# EAGLE design sfg_clone (EAGLE 7.5.0)
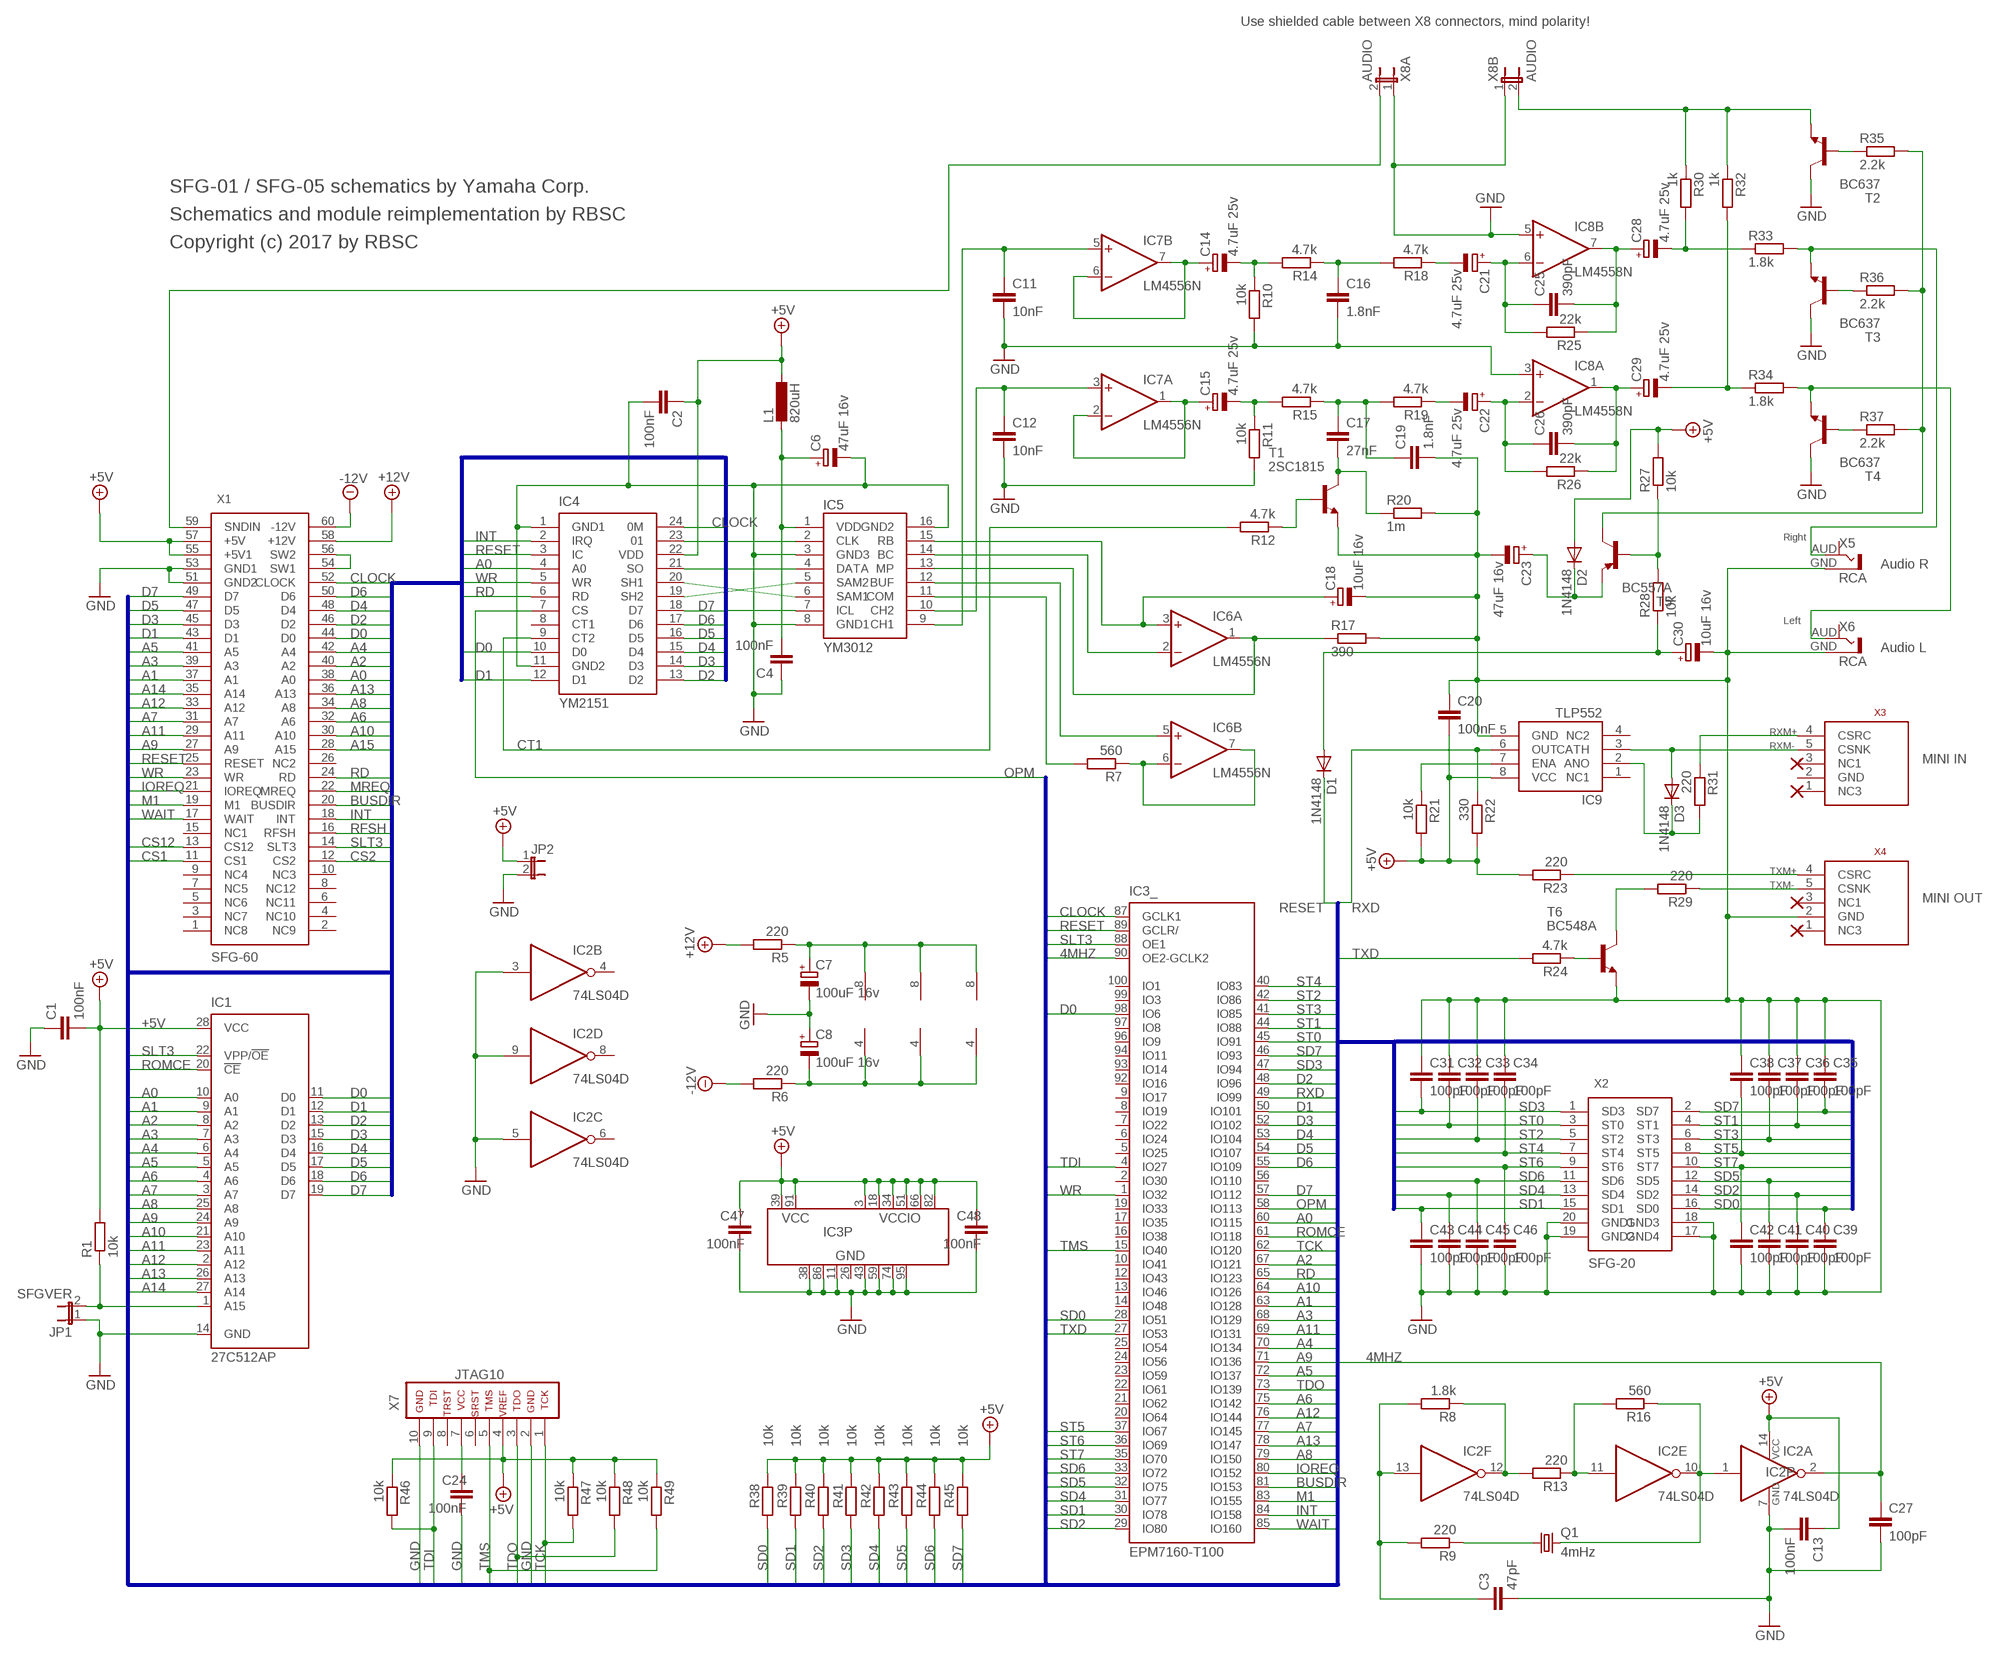
[diagram p0: schematic, sheet 1]

## Parts
C1  100nF  C-EUC0805  [C0805]
C2  100nF  C-EUC0805  [C0805]
C3  47pF  C-EUC0805  [C0805]
C4  100nF  C-EUC0805  [C0805]
C6  47uF 16v  CPOL-EUSMCC  [SMC_C]
C7  100uF 16v  CPOL-EUSMCD  [SMC_D]
C8  100uF 16v  CPOL-EUSMCD  [SMC_D]
C11  10nF  C-EUC0805  [C0805]
C12  10nF  C-EUC0805  [C0805]
C13  100nF  C-EUC0805  [C0805]
C14  4.7uF 25v  CPOL-EUSMCB  [SMC_B]
C15  4.7uF 25v  CPOL-EUSMCB  [SMC_B]
C16  1.8nF  C-EUC0805  [C0805]
C17  27nF  C-EUC0805  [C0805]
C18  10uF 16v  CPOL-EUSMCB  [SMC_B]
C19  1.8nF  C-EUC0805  [C0805]
C20  100nF  C-EUC0805  [C0805]
C21  4.7uF 25v  CPOL-EUSMCB  [SMC_B]
C22  4.7uF 25v  CPOL-EUSMCB  [SMC_B]
C23  47uF 16v  CPOL-EUSMCC  [SMC_C]
C24  100nF  C-EUC0805  [C0805]
C25  390pF  C-EUC0805  [C0805]
C26  390pF  C-EUC0805  [C0805]
C27  100pF  C-EUC0805  [C0805]
C28  4.7uF 25v  CPOL-EUSMCB  [SMC_B]
C29  4.7uF 25v  CPOL-EUSMCB  [SMC_B]
C30  10uF 16v  CPOL-EUSMCB  [SMC_B]
C31  100pF  C-EUC0805  [C0805]
C32  100pF  C-EUC0805  [C0805]
C33  100pF  C-EUC0805  [C0805]
C34  100pF  C-EUC0805  [C0805]
C35  100pF  C-EUC0805  [C0805]
C36  100pF  C-EUC0805  [C0805]
C37  100pF  C-EUC0805  [C0805]
C38  100pF  C-EUC0805  [C0805]
C39  100pF  C-EUC0805  [C0805]
C40  100pF  C-EUC0805  [C0805]
C41  100pF  C-EUC0805  [C0805]
C42  100pF  C-EUC0805  [C0805]
C43  100pF  C-EUC0805  [C0805]
C44  100pF  C-EUC0805  [C0805]
C45  100pF  C-EUC0805  [C0805]
C46  100pF  C-EUC0805  [C0805]
C47  100nF  C-EUC0805  [C0805]
C48  100nF  C-EUC0805  [C0805]
D1  1N4148  DIODE-MINIMELF  [MINIMELF]
D2  1N4148  DIODE-MINIMELF  [MINIMELF]
D3  1N4148  DIODE-MINIMELF  [MINIMELF]
IC1  27C512AP  [DIL28-6]
IC2  74LS04D  [SO14]
IC3  EPM7160-T100  [TQFP100]
IC4  YM2151  [DIL24]
IC5  YM3012  [DIL16]
IC6  LM4556N  [DIL08]
IC7  LM4556N  [DIL08]
IC8  LM4558N  [DIL08]
IC9  TLP552  [DIL08]
JP1  SFGVER  JP1E  [JP1]
JP2  JP1E  [JP1]
L1  820uH  L-EU6000-XXX-RC  [6000-XXXX-RC]
Q1  4mHz  CRYSTALHC49S  [HC49/S]
R1  10k  R-EU_R0805  [R0805]
R5  220  R-EU_R0805  [R0805]
R6  220  R-EU_R0805  [R0805]
R7  560  R-EU_R0805  [R0805]
R8  1.8k  R-EU_R0805  [R0805]
R9  220  R-EU_R0805  [R0805]
R10  10k  R-EU_R0805  [R0805]
R11  10k  R-EU_R0805  [R0805]
R12  4.7k  R-EU_R0805  [R0805]
R13  220  R-EU_R0805  [R0805]
R14  4.7k  R-EU_R0805  [R0805]
R15  4.7k  R-EU_R0805  [R0805]
R16  560  R-EU_R0805  [R0805]
R17  390  R-EU_R0805  [R0805]
R18  4.7k  R-EU_R0805  [R0805]
R19  4.7k  R-EU_R0805  [R0805]
R20  1m  R-EU_R0805  [R0805]
R21  10k  R-EU_R0805  [R0805]
R22  330  R-EU_R0805  [R0805]
R23  220  R-EU_R0805  [R0805]
R24  4.7k  R-EU_R0805  [R0805]
R25  22k  R-EU_R0805  [R0805]
R26  22k  R-EU_R0805  [R0805]
R27  10k  R-EU_R0805  [R0805]
R28  10k  R-EU_R0805  [R0805]
R29  220  R-EU_R0805  [R0805]
R30  1k  R-EU_R0805  [R0805]
R31  220  R-EU_R0805  [R0805]
R32  1k  R-EU_R0805  [R0805]
R33  1.8k  R-EU_R0805  [R0805]
R34  1.8k  R-EU_R0805  [R0805]
R35  2.2k  R-EU_R0805  [R0805]
R36  2.2k  R-EU_R0805  [R0805]
R37  2.2k  R-EU_R0805  [R0805]
R38  10k  R-EU_R0805  [R0805]
R39  10k  R-EU_R0805  [R0805]
R40  10k  R-EU_R0805  [R0805]
R41  10k  R-EU_R0805  [R0805]
R42  10k  R-EU_R0805  [R0805]
R43  10k  R-EU_R0805  [R0805]
R44  10k  R-EU_R0805  [R0805]
R45  10k  R-EU_R0805  [R0805]
R46  10k  R-EU_R0805  [R0805]
R47  10k  R-EU_R0805  [R0805]
R48  10k  R-EU_R0805  [R0805]
R49  10k  R-EU_R0805  [R0805]
T1  2SC1815  [TO92-ECB]
T2  BC637  BC637-NPN-TO92-ECB  [TO92-ECB]
T3  BC637  BC637-NPN-TO92-ECB  [TO92-ECB]
T4  BC637  BC637-NPN-TO92-ECB  [TO92-ECB]
T5  BC557A  [TO92-EBC]
T6  BC548A  [TO92-EBC]
X1  SFG-60  [SFG-60]
X2  SFG-20  [SFG-20]
X3  MIDI_CONN_FEMALE_SUPPORT  [DIN_5_FEMALE_SUPPORT]
X4  MIDI_CONN_FEMALE_SUPPORT  [DIN_5_FEMALE_SUPPORT]
X5  RCA  [RCA]
X6  RCA  [RCA]
X7  JTAG10  [JTAG10]
X8A  AUDIO  JP1E  [JP1]
X8B  AUDIO  JP1E  [JP1]

## Nets
4MHZ: C27.1 IC2.2(A:O) IC3.90(_:OE2-GCLK2)
+5V: C1.2 C2.1 C13.1 C20.2 C47.1 C48.1 D2.A IC1.28(VCC) IC2.14(P:VCC) IC3.3(P:VCCIO) IC3.18(P:VCCIO) IC3.34(P:VCCIO) IC3.39(P:VCC) IC3.51(P:VCCIO) IC3.66(P:VCCIO) IC3.82(P:VCCIO) IC3.91(P:VCC) IC4.22(VDD) IC9.8(VCC) JP2.1 L1.1 R1.2 R21.2 R22.2 R23.2 R27.2 R38.1 R39.1 R40.1 R41.1 R42.1 R43.1 R44.1 R45.1 R46.1 R47.1 R48.1 R49.1 X1.55(+5V1) X1.57(+5V) X7.4
+12V: R5.2 X1.58(+12V)
+12V1: C7.+ IC6.8(P:V+) IC7.8(P:V+) IC8.8(P:V+) R5.1
-12V: R6.2 X1.60(-12V)
-12V1: C8.- IC6.4(P:V-) IC7.4(P:V-) IC8.4(P:V-) R6.1
A0: IC1.10(A0) IC3.60(_:IO115) IC4.4(A0) X1.38(A0)
A1: IC1.9(A1) IC3.63(_:IO128) X1.37(A1)
A2: IC1.8(A2) IC3.67(_:IO121) X1.40(A2)
A3: IC1.7(A3) IC3.68(_:IO129) X1.39(A3)
A4: IC1.6(A4) IC3.70(_:IO134) X1.42(A4)
A5: IC1.5(A5) IC3.72(_:IO137) X1.41(A5)
A6: IC1.4(A6) IC3.75(_:IO142) X1.32(A6)
A7: IC1.3(A7) IC3.77(_:IO145) X1.31(A7)
A8: IC1.25(A8) IC3.79(_:IO150) X1.34(A8)
A9: IC1.24(A9) IC3.71(_:IO136) X1.27(A9)
A10: IC1.21(A10) IC3.64(_:IO126) X1.30(A10)
A11: IC1.23(A11) IC3.69(_:IO131) X1.29(A11)
A12: IC1.2(A12) IC3.76(_:IO144) X1.33(A12)
A13: IC1.26(A13) IC3.78(_:IO147) X1.36(A13)
A14: IC1.27(A14) X1.35(A14)
A15: X1.28(A15)
BUSDIR: IC3.81(_:IO153) X1.20(BUSDIR)
CLOCK: IC3.87(_:GCLK1) IC4.24(0M) X1.52(CLOCK)
CS1: X1.11(CS1)
CS2: X1.12(CS2)
CS12: X1.13(CS12)
CT1: IC4.9(CT2) R12.2
D0: IC1.11(D0) IC3.98(_:IO6) IC4.10(D0) X1.44(D0)
D1: IC1.12(D1) IC3.50(_:IO101) IC4.12(D1) X1.43(D1)
D2: IC1.13(D2) IC3.48(_:IO96) IC4.13(D2) X1.46(D2)
D3: IC1.15(D3) IC3.52(_:IO102) IC4.14(D3) X1.45(D3)
D4: IC1.16(D4) IC3.53(_:IO104) IC4.15(D4) X1.48(D4)
D5: IC1.17(D5) IC3.54(_:IO107) IC4.16(D5) X1.47(D5)
D6: IC1.18(D6) IC3.55(_:IO109) IC4.17(D6) X1.50(D6)
D7: IC1.19(D7) IC3.57(_:IO112) IC4.18(D7) X1.49(D7)
GND: C1.1 C2.2 C3.2 C4.1 C6.- C7.- C8.+ C11.2 C12.2 C13.2 C16.2 C18.- C19.2 C20.1 C23.- C24.2 C27.2 C30.- C31.1 C32.1 C33.1 C34.1 C35.1 C36.1 C37.1 C38.1 C39.2 C40.2 C41.2 C42.2 C43.2 C44.2 C45.2 C46.2 C47.2 C48.2 IC1.14(GND) IC2.3(B:I) IC2.5(C:I) IC2.7(P:GND) IC2.9(D:I) IC3.11(P:GND) IC3.38(P:GND) IC3.43(P:GND) IC3.59(P:GND) IC3.74(P:GND) IC3.86(P:GND) IC3.95(P:GND) IC4.1(GND1) IC4.11(GND2) IC5.3(GND3) IC5.8(GND1) IC5.16(GND2) IC8.3(A:+IN) IC8.5(B:+IN) IC9.5(GND) JP1.1 JP2.2 R10.2 R11.2 R17.2 R20.2 T1.E T2.C T3.C T4.C T6.E X1.51(GND2) X1.53(GND1) X2.17(GND4) X2.18(GND3) X2.19(GND2) X2.20(GND1) X4.2(GND) X5.GND(GND1) X6.GND(GND1) X7.2 X7.10 X8A.1 X8B.1
INT: IC3.84(_:IO158) IC4.2(IRQ) X1.18(INT)
IOREQ: IC3.80(_:IO152) X1.21(IOREQ)
M1: IC3.83(_:IO155) X1.19(M1)
MREQ: X1.22(MREQ)
N$1: IC1.1(A15) JP1.2 R1.1
N$2: C24.1 X7.7
N$3: X1.54(SW1) X1.56(SW2)
N$4: R30.1 R32.1 T2.E X8B.2
N$5: X1.59(SNDIN) X8A.2
N$8: C3.1 IC2.13(F:I) R8.2 R9.2
N$13: IC2.12(F:O) R8.1 R13.2
N$15: IC2.1(A:I) IC2.10(E:O) Q1.2 R16.1
N$16: Q1.1 R9.1
N$17: IC2.11(E:I) R13.1 R16.2
N$21: R24.1 T6.B
N$22: R29.2 T6.C
N$23: R29.1 X4.5(CSNK)
N$24: R23.1 X4.4(CSRC)
N$26: D3.A IC9.3(CATH) X3.5(CSNK)
N$27: R31.1 X3.4(CSRC)
N$28: IC9.7(ENA) R21.1
N$29: D3.C IC9.2(ANO) R31.2
N$30: IC4.23 IC5.2(CLK)
N$31: IC4.21(SO) IC5.4(DATA)
N$32: C28.- R30.2 R33.1
N$33: IC4.20(SH1) IC5.6(SAM1)
N$34: C4.2 C6.+ IC5.1(VDD) L1.2
N$35: IC4.19(SH2) IC5.5(SAM2)
N$37: IC6.6(B:-IN) IC6.7(B:OUT) R7.1
N$38: IC5.11(COM) R7.2
N$39: C12.1 IC5.10(CH2) IC7.3(A:+IN)
N$40: IC5.12(BUF) IC6.5(B:+IN)
N$41: IC5.13(MP) IC6.1(A:OUT) R17.1
N$42: C18.+ IC5.15(RB) IC6.3(A:+IN)
N$43: C21.+ C25.1 IC8.6(B:-IN) R25.2
N$44: C14.+ IC7.6(B:-IN) IC7.7(B:OUT)
N$45: C15.+ IC7.1(A:OUT) IC7.2(A:-IN)
N$46: C11.1 IC5.9(CH1) IC7.5(B:+IN)
N$47: C14.- R10.1 R14.2
N$48: C15.- R11.1 R15.2
N$49: IC5.14(BC) IC6.2(A:-IN)
N$50: C17.2 R20.1 T1.C
N$51: C16.1 R14.1 R18.2
N$52: C17.1 C19.1 R15.1 R19.2
N$53: C22.+ C26.1 IC8.2(A:-IN) R26.2
N$54: C22.- R19.1
N$55: C21.- R18.1
N$56: R12.1 T1.B
N$57: C26.2 C29.+ IC8.1(A:OUT) R26.1
N$58: C25.2 C28.+ IC8.7(B:OUT) R25.1
N$60: C29.- R32.2 R34.1
N$61: R33.2 T3.E X5.AUD
N$62: R34.2 T4.E X6.AUD
N$63: R35.1 T2.B
N$64: R35.2 R36.2 R37.2 T5.C
N$65: R36.1 T3.B
N$66: R37.1 T4.B
N$67: C30.+ D1.A R28.1
N$68: C23.+ D2.C T5.E
N$69: R27.1 R28.2 T5.B
OPM: IC3.58(_:IO113) IC4.7(CS)
RD: IC3.65(_:IO123) IC4.6(RD) X1.24(RD)
RESET: D1.C IC3.89(_:GCLR/) IC4.3(IC) IC5.7(ICL) X1.25(RESET)
RFSH: X1.16(RFSH)
ROMCE: IC1.20(!CE) IC3.61(_:IO118)
RXD: IC3.49(_:IO99) IC9.6(OUT) R22.1
SD0: C39.1 IC3.28(_:IO51) R38.2 X2.16(SD0)
SD1: C43.1 IC3.30(_:IO78) R39.2 X2.15(SD1)
SD2: C40.1 IC3.29(_:IO80) R40.2 X2.14(SD2)
SD3: C31.2 IC3.47(_:IO94) R41.2 X2.1(SD3)
SD4: C44.1 IC3.31(_:IO77) R42.2 X2.13(SD4)
SD5: C41.1 IC3.32(_:IO75) R43.2 X2.12(SD5)
SD6: C45.1 IC3.33(_:IO72) R44.2 X2.11(SD6)
SD7: C35.2 IC3.46(_:IO93) R45.2 X2.2(SD7)
SLT3: IC1.22(VPP/!OE) IC3.88(_:OE1) X1.14(SLT3)
ST0: C32.2 IC3.45(_:IO91) X2.3(ST0)
ST1: C36.2 IC3.44(_:IO88) X2.4(ST1)
ST2: C33.2 IC3.42(_:IO86) X2.5(ST2)
ST3: C37.2 IC3.41(_:IO85) X2.6(ST3)
ST4: C34.2 IC3.40(_:IO83) X2.7(ST4)
ST5: C38.2 IC3.37(_:IO67) X2.8(ST5)
ST6: C46.1 IC3.36(_:IO69) X2.9(ST6)
ST7: C42.1 IC3.35(_:IO70) X2.10(ST7)
TCK: IC3.62(_:IO120) R47.2 X7.1
TDI: IC3.4(_:IO27) R46.2 X7.9
TDO: IC3.73(_:IO139) R48.2 X7.3
TMS: IC3.15(_:IO40) R49.2 X7.5
TXD: IC3.27(_:IO53) R24.2
WAIT: IC3.85(_:IO160) X1.17(WAIT)
WR: IC3.1(_:IO32) IC4.5(WR) X1.23(WR)
Unconnected: IC2.4(B:O) IC2.6(C:O) IC2.8(D:O) IC3.2(_:IO30) IC3.5(_:IO25) IC3.6(_:IO24) IC3.7(_:IO22) IC3.8(_:IO19) IC3.9(_:IO17) IC3.10(_:IO41) IC3.12(_:IO43) IC3.13(_:IO46) IC3.14(_:IO48) IC3.16(_:IO38) IC3.17(_:IO35) IC3.19(_:IO33) IC3.20(_:IO64) IC3.21(_:IO62) IC3.22(_:IO61) IC3.23(_:IO59) IC3.24(_:IO56) IC3.25(_:IO54) IC3.56(_:IO110) IC3.92(_:IO16) IC3.93(_:IO14) IC3.94(_:IO11) IC3.96(_:IO9) IC3.97(_:IO8) IC3.99(_:IO3) IC3.100(_:IO1) IC4.8(CT1) IC9.1(NC1) IC9.4(NC2) X1.1(NC8) X1.2(NC9) X1.3(NC7) X1.4(NC10) X1.5(NC6) X1.6(NC11) X1.7(NC5) X1.8(NC12) X1.9(NC4) X1.10(NC3) X1.15(NC1) X1.26(NC2) X3.1(NC3) X3.2(GND) X3.3(NC1) X4.1(NC3) X4.3(NC1) X5.AUD1 X6.AUD1 X7.6 X7.8

## Buses
ST0,ST1,ST2,ST3,ST4,ST5,ST6,ST7,SD0,SD1,SD2,SD3,SD4,SD5,SD6,SD7
D0,D1,D2,D3,D4,D5,D6,D7,A0,A1,A2,A3,A4,A5,A6,A7,A8,A9,A10,A11,A12,A13,A14,A15,CS1,CS2,CS12,SLT3,RFSH,WAIT,INT,M1,BUSDIR,IOREQ,MREQ,WR,RD,RESET,GND,CLOCK,SW1,SW2,4MHZ,CS,OPM,TXD,RXD,ST0,ST1,ST2,ST3,ST4,ST5,ST6,ST7,SD0,SD1,SD2,SD3,SD4,SD5,SD6,SD7,TDI,TMS,TDO,TCK,ROMCE

## Notes on the sheet
- Use shielded cable between X8 connectors, mind polarity!
- SFG-01 / SFG-05 schematics by Yamaha Corp.
- Schematics and module reimplementation by RBSC
- Copyright (c) 2017 by RBSC
- Right
- Audio R
- Left
- Audio L
- RXM+
- RXM-
- MINI IN
- TXM+
- TXM-
- MINI OUT

## Power pins joined to a net without a drawn wire
GND: IC3.26(P:GND)

## Library data of the parts
C1-C4 C11-C13 C16 C17 C19 C20 C24-C27 C31-C48 = rcl:C-EU: CAPACITOR, European symbol
C6-C8 C14 C15 C18 C21-C23 C28-C30 = rcl:CPOL-EU: POLARIZED CAPACITOR, European symbol
D1-D3 = diode:DIODE-: DIODE
IC1 = microchip:27*512A: CMOS EPROM 512 K (64 K x 8); MPN: M27C512-90B6; OC_FARNELL: 1642690; OC_NEWARK: 20M6389
IC2 = 74xx-eu:74*04: Hex INVERTER
IC3 = altera:EPM7160-?100: EPM7160E MAX 7000 family; MPN: EPM7160STC100-10N; OC_FARNELL: 1549429; OC_NEWARK: 51R9804
IC4 = ym2151:YM2151: SFG OPM Chip
IC5 = ym3012:YM3012: YM3012
IC6 IC7 = LM4556:*4556: OP AMP
IC8 = LM4558:*4558: OP AMP
IC9 = TLP552:TLP552: Optocoupler
JP1 JP2 X8A X8B = jumper:JP1E: JUMPER
L1 = rcl:L-EU: INDUCTOR, European symbol
Q1 = crystal:CRYSTAL: CRYSTAL; OC_FARNELL: 1667008; OC_NEWARK: unknown
R1 R5-R49 = resistor:R-EU_: RESISTOR, European symbol
T1 = transistor:2SC1815: NPN EPITAXIAL TRANSISTOR Source: TOSHIBA .. 2SC1815 1.pdf
T2-T4 = transistor:*-NPN-: NPN Transistror BF959 corrected 2008.03.06
T5 = transistor-pnp:BC557*: PNP Transistror
T6 = transistor-npn:BC548*: NPN Transistor
X1 = sfg-60:SFG-60: 60-pin connector side slot
X2 = sfg-20:SFG-20: 20-pin connector for keyboards
X3 X4 = SparkFun-Connectors:MIDI_CONN_FEMALE_SUPPORT: MIDI connector with strain relief (DIN-5 female)
X5 X6 = rca:RCA: RCA connector Cinch
X7 = jtag:JTAG10: AVR JTAG Debug/Programming Header

## Board
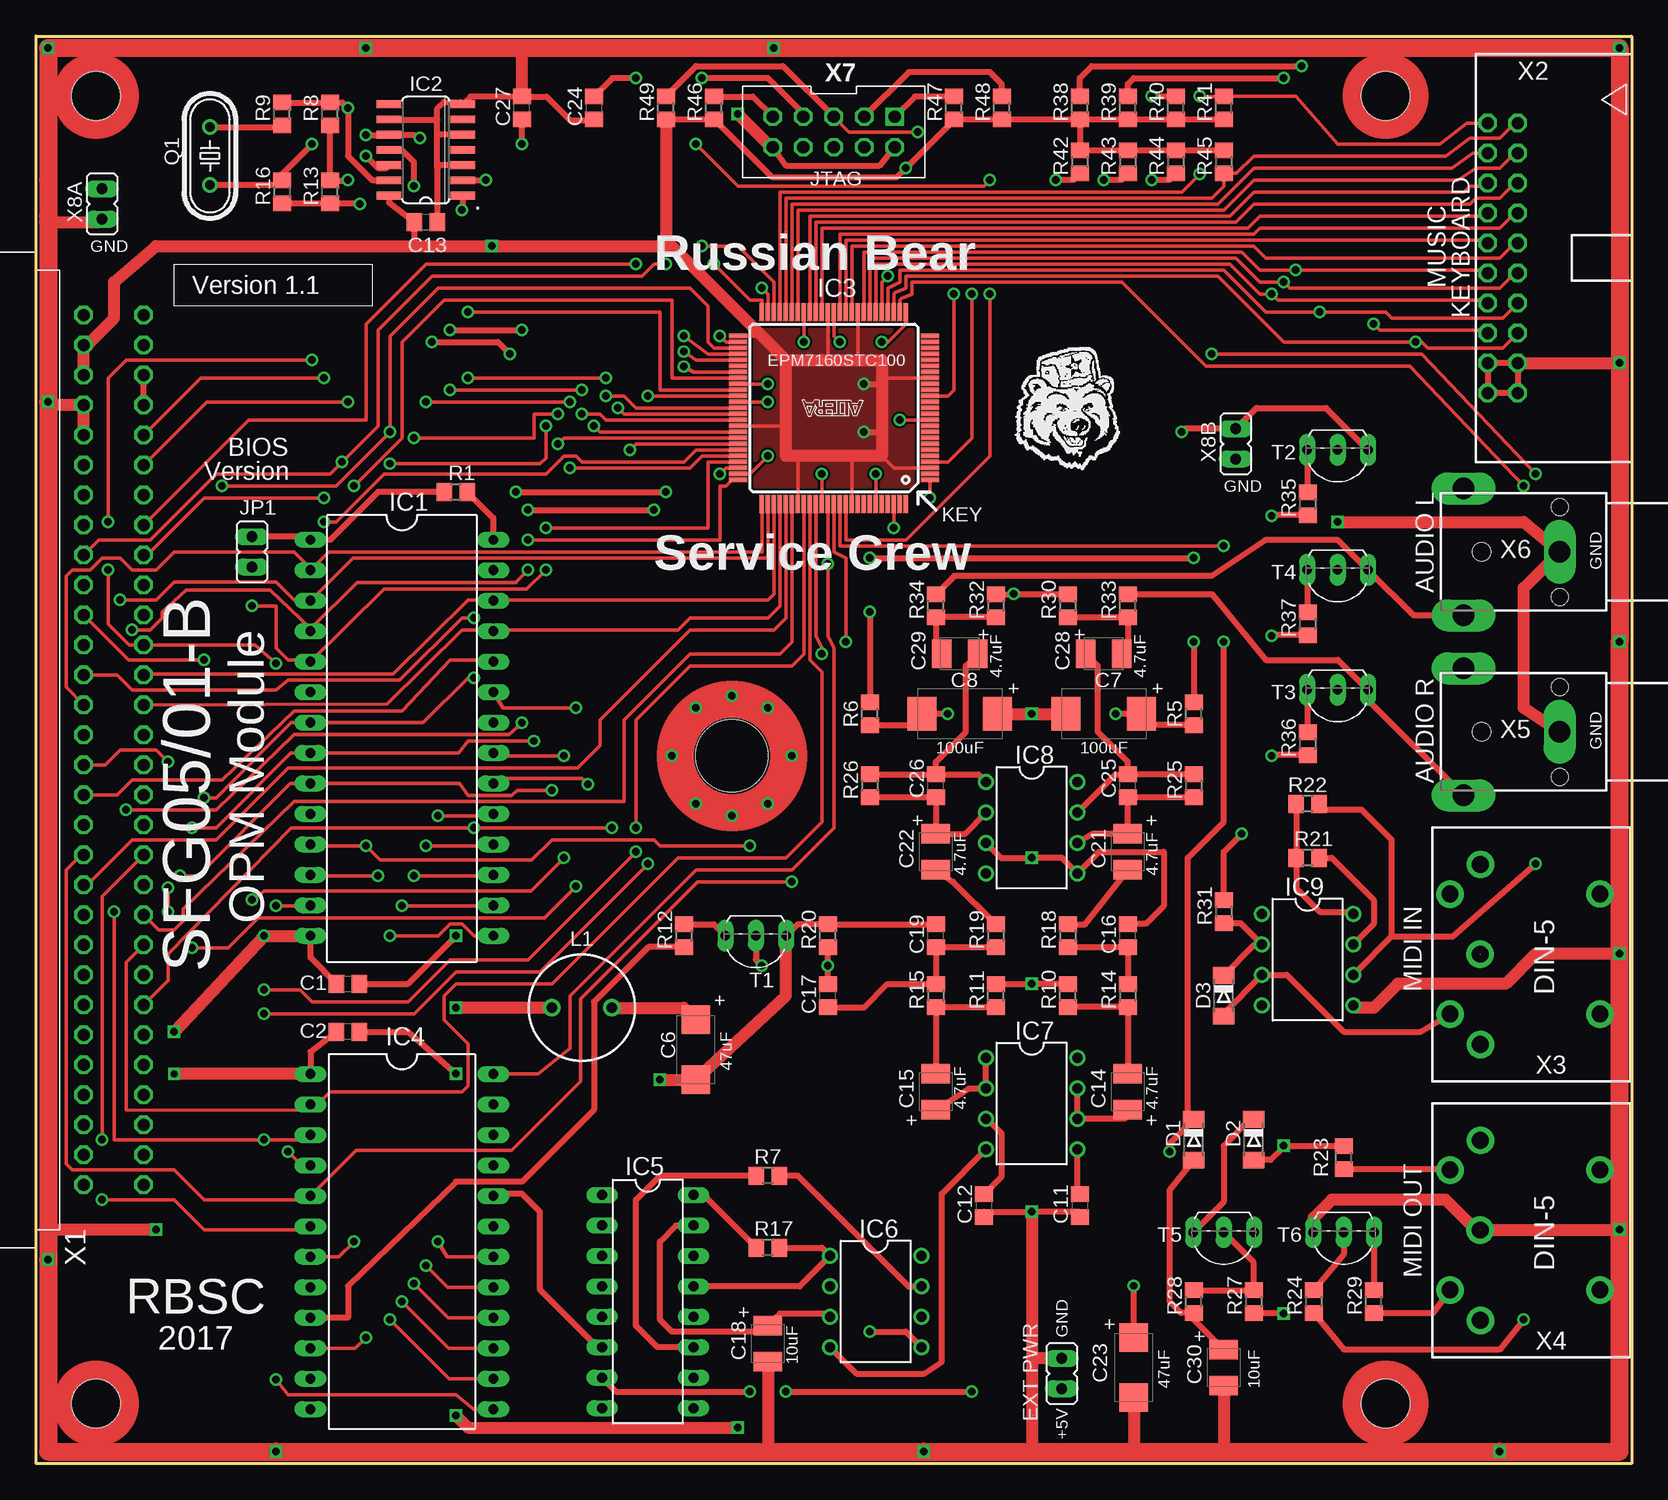
[diagram p1: board, top side]
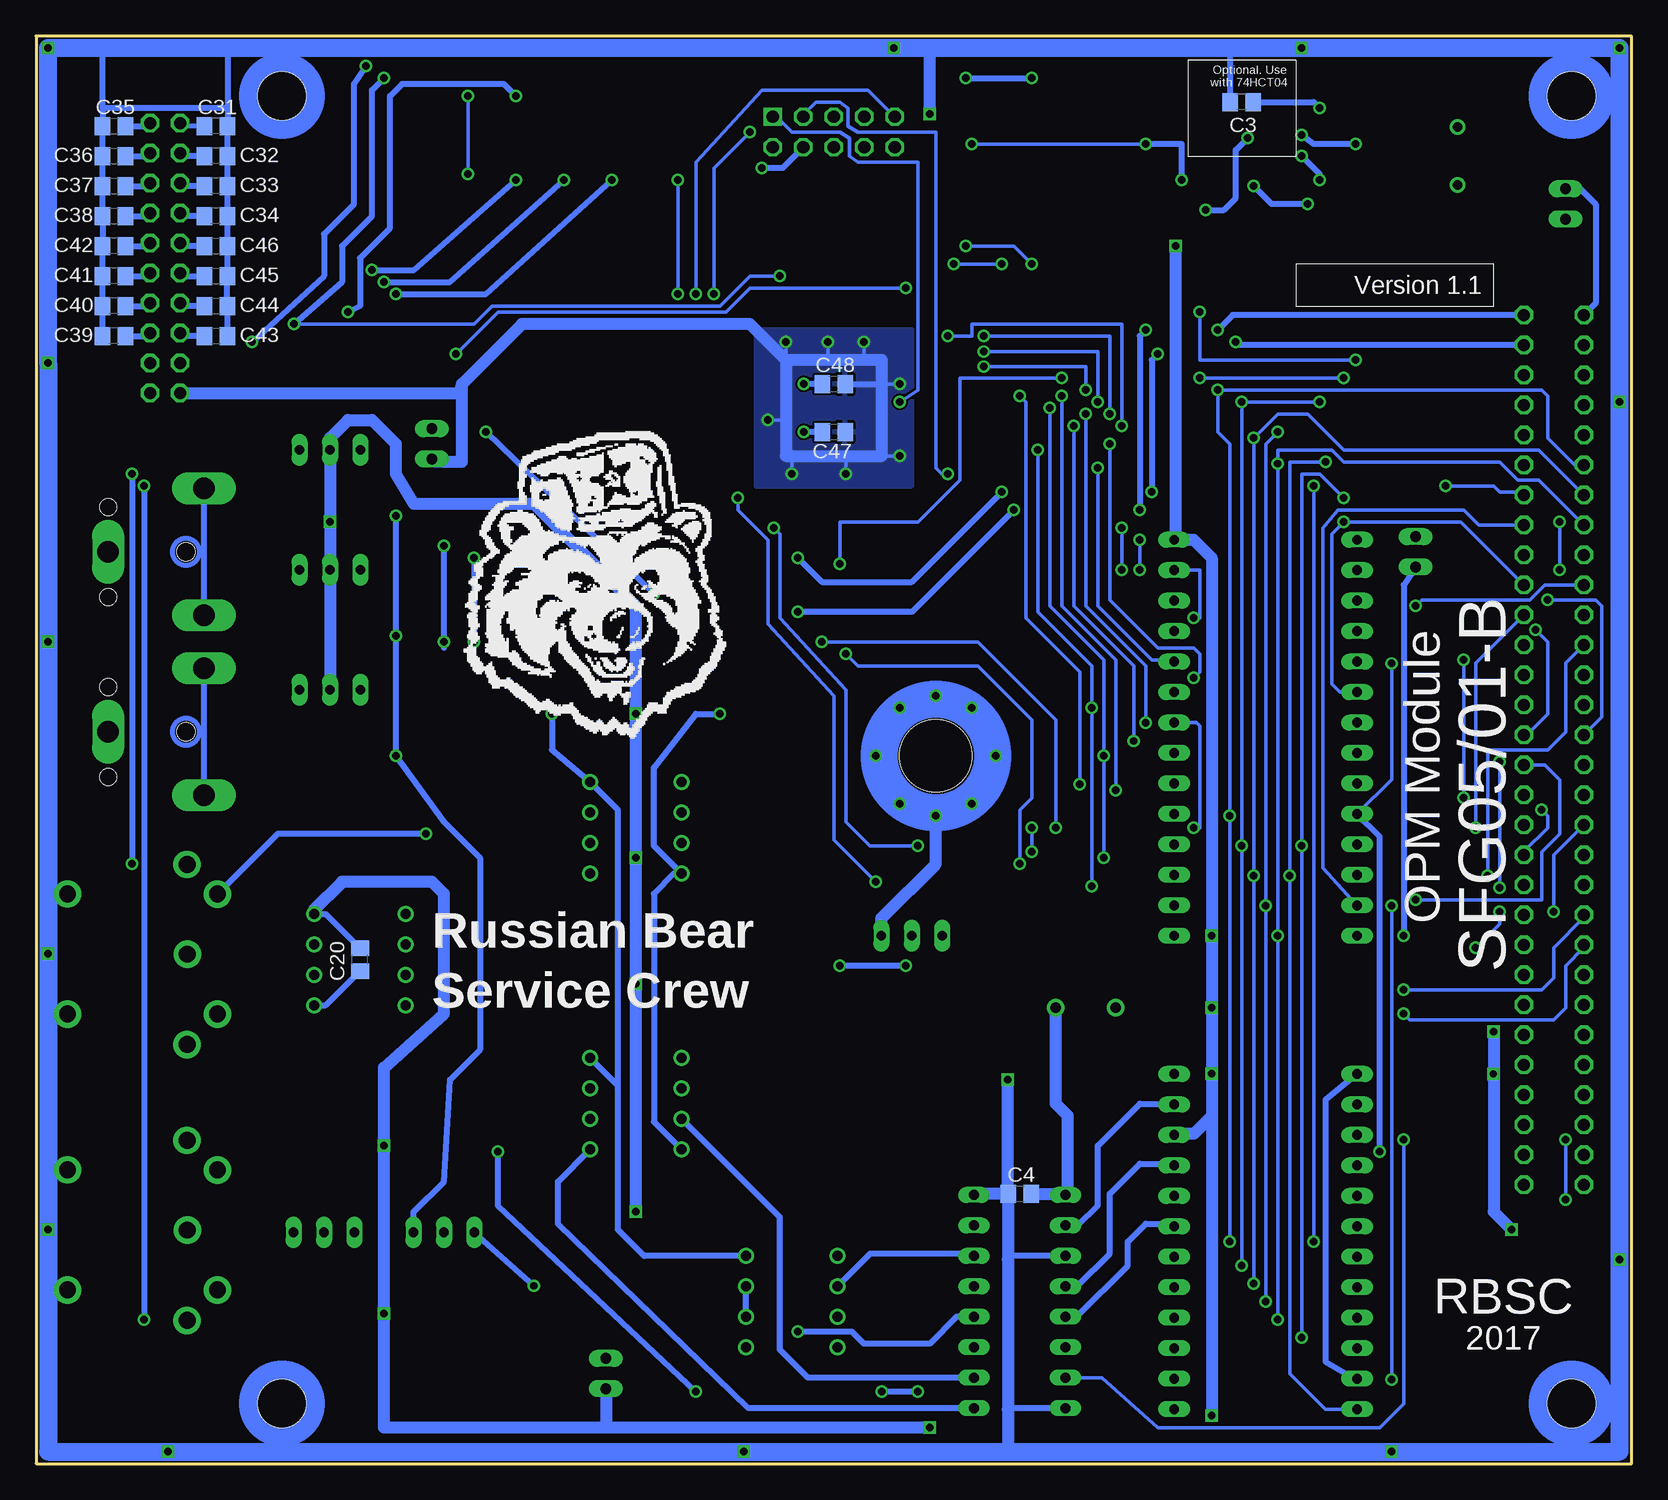
[diagram p2: board, bottom side, seen from below]

Size 133 x 119 mm. Coordinates in mm from the lower left corner, seen from the top.
Outline: 0,0 0,119 133,119 133,0 0,0
Copper layers (1*16): Top 0.035mm / dielectric 1.5mm / Bottom 0.035mm
Design rules "default *": minimum track width 10mil, minimum drill 24mil, track to track 7mil, track to pad 8mil, pad to pad 8mil, via to via 8mil, smd to smd 8mil, copper to edge 4mil, drill to drill 8mil, minimum pad ring 10mil, minimum via ring 8mil, stop-mask expansion 4mil, vias tented up to drill 24mil, thermal gap 10mil
Holes 4 mm at 5,114 5,5 112.5,114 112.5,5
Holes 6 mm at 58,59

### Footprints (pad centres in the part's own frame; a part is rotated, then mirrored left to right if it is on the bottom)
C0805 = smd 1.3 x 1.5: 1 -0.95,0; 2 0.95,0
SMC_C = smd 2.4 x 2.4: + -2.5,0; - 2.5,0
SMC_D = smd 2.4 x 2.8: + -3.15,0; - 3.15,0
SMC_B = smd 1.6 x 2.4: + -1.5,0; - 1.5,0
MINIMELF = smd 1.4 x 1.8: A 1.7,0; C -1.7,0
DIL28-6 = drill 0.813 long: 1 -16.51,-7.62; 2 -13.97,-7.62; 3 -11.43,-7.62; 4 -8.89,-7.62; 5 -6.35,-7.62; 6 -3.81,-7.62; 7 -1.27,-7.62; 8 1.27,-7.62; 9 3.81,-7.62; 10 6.35,-7.62; 11 8.89,-7.62; 12 11.43,-7.62; 13 13.97,-7.62; 14 16.51,-7.62; 15 16.51,7.62; 16 13.97,7.62; 17 11.43,7.62; 18 8.89,7.62; 19 6.35,7.62; 20 3.81,7.62; 21 1.27,7.62; 22 -1.27,7.62; 23 -3.81,7.62; 24 -6.35,7.62; 25 -8.89,7.62; 26 -11.43,7.62; 27 -13.97,7.62; 28 -16.51,7.62
SO14 = smd 0.66 x 2.032: 1 -3.81,-3.073; 2 -2.54,-3.073; 3 -1.27,-3.073; 4 0,-3.073; 5 1.27,-3.073; 6 2.54,-3.073; 7 3.81,-3.073; 8 3.81,3.073; 9 2.54,3.073; 10 1.27,3.073; 11 0,3.073; 12 -1.27,3.073; 13 -2.54,3.073; 14 -3.81,3.073
TQFP100 = smd 1.5 x 0.35: 1 -8,6; 2 -8,5.5; 3 -8,5; 4 -8,4.5; 5 -8,4; 6 -8,3.5; 7 -8,3; 8 -8,2.5; 9 -8,2; 10 -8,1.5; 11 -8,1; 12 -8,0.5; 13 -8,0; 14 -8,-0.5; 15 -8,-1; 16 -8,-1.5; 17 -8,-2; 18 -8,-2.5; 19 -8,-3; 20 -8,-3.5; 21 -8,-4; 22 -8,-4.5; 23 -8,-5; 24 -8,-5.5; 25 -8,-6; 51 8,-6; 52 8,-5.5; 53 8,-5; 54 8,-4.5; 55 8,-4; 56 8,-3.5; 57 8,-3; 58 8,-2.5; 59 8,-2; 60 8,-1.5; 61 8,-1; 62 8,-0.5; 63 8,0; 64 8,0.5; 65 8,1; 66 8,1.5; 67 8,2; 68 8,2.5; 69 8,3; 70 8,3.5; 71 8,4; 72 8,4.5; 73 8,5; 74 8,5.5; 75 8,6 | smd 0.35 x 1.5: 26 -6,-8; 27 -5.5,-8; 28 -5,-8; 29 -4.5,-8; 30 -4,-8; 31 -3.5,-8; 32 -3,-8; 33 -2.5,-8; 34 -2,-8; 35 -1.5,-8; 36 -1,-8; 37 -0.5,-8; 38 0,-8; 39 0.5,-8; 40 1,-8; 41 1.5,-8; 42 2,-8; 43 2.5,-8; 44 3,-8; 45 3.5,-8; 46 4,-8; 47 4.5,-8; 48 5,-8; 49 5.5,-8; 50 6,-8; 76 6,8; 77 5.5,8; 78 5,8; 79 4.5,8; 80 4,8; 81 3.5,8; 82 3,8; 83 2.5,8; 84 2,8; 85 1.5,8; 86 1,8; 87 0.5,8; 88 0,8; 89 -0.5,8; 90 -1,8; 91 -1.5,8; 92 -2,8; 93 -2.5,8; 94 -3,8; 95 -3.5,8; 96 -4,8; 97 -4.5,8; 98 -5,8; 99 -5.5,8; 100 -6,8
DIL24 = drill 0.813 long: 1 -13.97,-7.62; 2 -11.43,-7.62; 3 -8.89,-7.62; 4 -6.35,-7.62; 5 -3.81,-7.62; 6 -1.27,-7.62; 7 1.27,-7.62; 8 3.81,-7.62; 9 6.35,-7.62; 10 8.89,-7.62; 11 11.43,-7.62; 12 13.97,-7.62; 13 13.97,7.62; 14 11.43,7.62; 15 8.89,7.62; 16 6.35,7.62; 17 3.81,7.62; 18 1.27,7.62; 19 -1.27,7.62; 20 -3.81,7.62; 21 -6.35,7.62; 22 -8.89,7.62; 23 -11.43,7.62; 24 -13.97,7.62
DIL16 = drill 0.813 long: 1 -8.89,-3.81; 2 -6.35,-3.81; 3 -3.81,-3.81; 4 -1.27,-3.81; 5 1.27,-3.81; 6 3.81,-3.81; 7 6.35,-3.81; 8 8.89,-3.81; 9 8.89,3.81; 10 6.35,3.81; 11 3.81,3.81; 12 1.27,3.81; 13 -1.27,3.81; 14 -3.81,3.81; 15 -6.35,3.81; 16 -8.89,3.81
DIL08 = drill 0.813 pad 1.27: 1 -3.81,-3.81; 2 -1.27,-3.81; 3 1.27,-3.81; 4 3.81,-3.81; 5 3.81,3.81; 6 1.27,3.81; 7 -1.27,3.81; 8 -3.81,3.81
JP1 = drill 0.914 long: 1 0,-1.27; 2 0,1.27
6000-XXXX-RC = drill 0.9 pad 1.422: 1 -2.5,0; 2 2.5,0
HC49/S = drill 0.813: 1 -2.413,0; 2 2.413,0
R0805 = smd 1.3 x 1.5: 1 -0.95,0; 2 0.95,0
TO92-ECB = drill 0.813 long: B 2.54,0; C 0,0; E -2.54,0
TO92-EBC = drill 0.813 long: B 0,-1.27; C -2.54,-1.27; E 2.54,-1.27
SFG-60 = drill 1 octagon: 1 -36.25,3.54; 2 -36.25,-1.46; 3 -33.75,3.54; 4 -33.75,-1.46; 5 -31.25,3.54; 6 -31.25,-1.46; 7 -28.75,3.54; 8 -28.75,-1.46; 9 -26.25,3.54; 10 -26.25,-1.46; 11 -23.75,3.54; 12 -23.75,-1.46; 13 -21.25,3.54; 14 -21.25,-1.46; 15 -18.75,3.54; 16 -18.75,-1.46; 17 -16.25,3.54; 18 -16.25,-1.46; 19 -13.75,3.54; 20 -13.75,-1.46; 21 -11.25,3.54; 22 -11.25,-1.46; 23 -8.75,3.54; 24 -8.75,-1.46; 25 -6.25,3.54; 26 -6.25,-1.46; 27 -3.75,3.54; 28 -3.75,-1.46; 29 -1.25,3.54; 30 -1.25,-1.46; 31 1.25,3.54; 32 1.25,-1.46; 33 3.75,3.54; 34 3.75,-1.46; 35 6.25,3.54; 36 6.25,-1.46; 37 8.75,3.54; 38 8.75,-1.46; 39 11.25,3.54; 40 11.25,-1.46; 41 13.75,3.54; 42 13.75,-1.46; 43 16.25,3.54; 44 16.25,-1.46; 45 18.75,3.54; 46 18.75,-1.46; 47 21.25,3.54; 48 21.25,-1.46; 49 23.75,3.54; 50 23.75,-1.46; 51 26.25,3.54; 52 26.25,-1.46; 53 28.75,3.54; 54 28.75,-1.46; 55 31.25,3.54; 56 31.25,-1.46; 57 33.75,3.54; 58 33.75,-1.46; 59 36.25,3.54; 60 36.25,-1.46
SFG-20 = drill 1 octagon: 1 5.75,1; 2 5.75,3.5; 3 8.25,1; 4 8.25,3.5; 5 10.75,1; 6 10.75,3.5; 7 13.25,1; 8 13.25,3.5; 9 15.75,1; 10 15.75,3.5; 11 18.25,1; 12 18.25,3.5; 13 20.75,1; 14 20.75,3.5; 15 23.25,1; 16 23.25,3.5; 17 25.75,1; 18 25.75,3.5; 19 28.25,1; 20 28.25,3.5
DIN_5_FEMALE_SUPPORT = drill 1.4 pad 2.286: 1 7.94,3.6; 2 0.46,3.61; 3 -7.07,3.6; 4 5.47,6.13; 5 -4.53,6.12; 6 -4.53,-6.382; 7 5.478,-6.382
RCA = drill 1.778 pad 2.2 long: AUD 5.3,-12; AUD1 -5.283,-12; GND 0,-4 | hole 1.4: -3.75,-4; 3.75,-4 | hole 1.5: 0,-10.5
JTAG10 = drill 1.016 square: 1 -5.08,-1.27 | drill 1.016 octagon: 2 -5.08,1.27; 3 -2.54,-1.27; 4 -2.54,1.27; 5 0,-1.27; 6 0,1.27; 7 2.54,-1.27; 8 2.54,1.27; 9 5.08,-1.27; 10 5.08,1.27

### Placement (x,y rotation side)
C1  26,40 0 top
C2  26,36 180 top
C3  32.5,113.5 180 bottom
C4  51,22.5 0 bottom
C6  55,34.5 270 top
C7  89,62.5 180 top
C8  77,62.5 180 top
C11  87,21.5 270 top
C12  79,21.5 270 top
C13  32.5,103.5 0 top
C14  91,31 90 top
C15  75,31 90 top
C16  91,44 90 top
C17  66,39 90 top
C18  61,10 270 top
C19  75,44 90 top
C20  106,42 90 bottom
C21  91,51 270 top
C22  75,51 270 top
C23  91.5,8 270 top
C24  46.5,113 270 top
C25  91,56.5 90 top
C26  75,56.5 90 top
C27  40.5,113 90 top
C28  89,67.5 0 top
C29  77,67.5 180 top
C30  99,8 270 top
C31  118,111.5 180 bottom
C32  118,109 180 bottom
C33  118,106.5 180 bottom
C34  118,104 180 bottom
C35  126.5,111.5 0 bottom
C36  126.5,109 0 bottom
C37  126.5,106.5 0 bottom
C38  126.5,104 0 bottom
C39  126.5,94 180 bottom
C40  126.5,96.5 180 bottom
C41  126.5,99 180 bottom
C42  126.5,101.5 180 bottom
C43  118,94 0 bottom
C44  118,96.5 0 bottom
C45  118,99 0 bottom
C46  118,101.5 0 bottom
C47  66.5,86 0 bottom
C48  66.5,90 0 bottom
D1  96.5,27 270 top
D2  101.5,27 270 top
D3  99,39 270 top
IC1  30.5,60.5 270 top
IC2  32.5,109.5 90 top
IC3  66.5,88 180 top
IC4  30.5,18.5 270 top
IC5  51,13.5 270 top
IC6  70,13.5 270 top
IC7  83,30 270 top
IC8  83,53 270 top
IC9  106,42 270 top
JP1  18,76 0 top
JP2  85.5,7.5 0 top
L1  45.5,38 0 top
Q1  14.5,109 270 top
R1  35,81 0 top
R5  96.5,62.5 90 top
R6  69.5,62.5 90 top
R7  61,24 180 top
R8  24.5,112.5 90 top
R9  20.5,112.5 90 top
R10  86,39 90 top
R11  80,39 90 top
R12  54,44 270 top
R13  24.5,106 90 top
R14  91,39 270 top
R15  75,39 270 top
R16  20.5,106 270 top
R17  61,18 180 top
R18  86,44 270 top
R19  80,44 270 top
R20  66,44 90 top
R21  106,50.5 180 top
R22  106,55 180 top
R23  109,25.5 90 top
R24  106.5,13.5 270 top
R25  96.5,56.5 270 top
R26  69.5,56.5 270 top
R27  101.5,13.5 270 top
R28  96.5,13.5 90 top
R29  111.5,13.5 90 top
R30  86,71.5 270 top
R31  99,46 270 top
R32  80,71.5 270 top
R33  91,71.5 90 top
R34  75,71.5 90 top
R35  106,80 270 top
R36  106,60 270 top
R37  106,70 270 top
R38  87,113 90 top
R39  91,113 90 top
R40  95,113 90 top
R41  99,113 90 top
R42  87,108.5 270 top
R43  91,108.5 270 top
R44  95,108.5 270 top
R45  99,108.5 270 top
R46  56.5,113 90 top
R47  76.5,113 90 top
R48  80.5,113 90 top
R49  52.5,113 90 top
T1  60,44 180 top
T2  108.5,84.5 180 top
T3  108.5,64.5 180 top
T4  108.5,74.5 180 top
T5  99,18 180 top
T6  109,18 180 top
X1  7.5,59.5 90 top
X2  120,117.5 270 top
X3  124,42 90 top
X4  124,19 90 top
X5  131,61 270 top
X6  131,76 270 top
X7  66.5,111 180 top
X8A  5.5,105 0 top
X8B  100,85 0 top

### Tracks (layer width: path | path; a pad name or v marks a point on that pad's centre or on a via)
4MHZ  (via drill 0.6)
  Top 0.3: IC3.90 67.5,77 72.5,77 79.5,84 v79.5,97.5 | v79.5,107 79,106.5 58.5,106.5 v55,110
  Top 0.5: IC2.2 37.46,106.96 v37.5,107 | v40.5,110 C27.1
  Bottom 0.3: v55,110 v40.5,110 | v79.5,97.5 v79.5,107
  Bottom 0.5: v37.5,107 37.5,110 v40.5,110
+5V  (via drill 0.6)
  Top 0.3: IC3.39 66,92.5 65.5,92 | IC3.66 62.5,86.5 | 68.5,92 IC3.34 | IC3.18 70.5,90.5 | IC3.91 68,84 | IC3.82 63.5,84 | IC3.3 71.5,83 70.5,84 | IC3.51 60,94 60.25,94.25
  Top 0.5: 31.5,101.5 31.55,101.55 C13.1 29.43,105.12 IC2.14 | R38.1 R39.1 R40.1 R41.1 | R38.1 R42.1 R43.1 R44.1 R45.1 | v69,90 70.5,90 | v69,86 70.5,86 | R49.1 R46.1 61.41,107.2 71.7,107.2 v72.5,108 76.5,112 R47.1 R48.1 R38.1 | 101.8,25 D2.A 102.9,25.3 104.05,26.45 | R27.2 103.95,12.55 v104,12.5 | IC9.8 109.62,46 107,46 105.05,47.95 R21.2 R22.2 | R1.2 38.12,78.83 IC1.28 | C1.2 31,40 v35,44 | C2.1 31,36 v35,32.5 | R23.2 104.05,26.45 | 104.05,26.45 v104,26.5
  Top 1: 52.5,101.5 v38,101.5 31.5,101.5 10,101.5 6.5,98.5 6.5,95.5 4.25,93.25 X1.57 X1.55 | 52.5,101.5 53,101.5 60.25,94.25 62.5,92 | 62.5,92 62.5,86.5 62.5,84 63.5,84 68,84 70.5,84 70.5,86 70.5,90 70.5,90.5 70.5,92 68.5,92 65.5,92 62.5,92 | L1.1 v35,38 | v35,4 36,3 v58.5,3 | R49.1 52.5,101.5
  Bottom 0.5: C48.1 v69,90 | IC9.8 108.86,45.81 C20.2 | C47.1 v69,86 | X7.4 70.77,108 v72.5,108
  Bottom 1: v38,101.5 38,77.5 38.12,76.88 IC1.28 36.51,77.01 35,75.5 v35,44 v35,38 v35,32.5 35,29 | 35,29 36.5,27.5 38.01,27.5 IC4.22 | 35,29 v35,4 | v58.5,3 85.5,3 | 85.5,3 104,3 v104,12.5 v104,26.5 104,33 99,37.5 99,47.5 100,48.5 107.5,48.5 109.81,46.19 IC9.8 | JP2.1 85.5,3
  pour Top: 60,94.5 73,94.5 73,81.5 60,81.5
+12V  (via drill 0.6)
  Top 0.5: v33,93.5 38.5,93.5 v39.5,92.5 | v40,81 v52.5,81 | v69.5,75.5 v96.5,75.5 | v96.5,68.5 R5.2
  Bottom 0.5: X1.58 32.75,93.25 v33,93.5 | v39.5,92.5 40,92 v40,81 | v52.5,81 60,73.5 67.5,73.5 v69.5,75.5 | v96.5,75.5 v96.5,68.5
+12V1  (via drill 0.6)
  Top 0.5: v90,62.5 C7.+ 93.1,61.55 R5.1
  Bottom 0.5: 86.81,34.19 IC7.8 84.5,31.5 | 84.5,31.5 84.5,54.5 IC8.8 90,59.5 v90,62.5 | 84.5,31.5 84.5,19.5 82.31,17.31 IC6.8
-12V  (via drill 0.6)
  Top 0.5: v34.5,94.5 v40.5,94.5 | v41,79.5 v51.5,79.5 | v69.5,71 R6.2
  Bottom 0.5: X1.60 33.25,95.75 v34.5,94.5 | v40.5,94.5 41,94 v41,79.5 | v51.5,79.5 60,71 v69.5,71
-12V1  (via drill 0.6)
  Top 0.5: IC6.4 68.38,7.5 74,7.5 75.5,8.5 75.5,22.5 IC7.4 | v76,62.5 C8.- 72.9,61.55 R6.1
  Bottom 0.5: IC7.4 81.5,28.5 81.5,47.5 79.81,49.19 IC8.4 81.5,51.5 81.5,58 78,62.5 v76,62.5
A0  (via drill 0.6)
  Top 0.3: 22.15,24.85 v21,26 | v20,66.7 18.25,68.25 X1.38 7.75,68.25 6,70 v6,74.5 | v6,78.5 6,90.5 7.5,92 v23,92 | IC3.60 52,89.5 52,96 v36,96
  Top 0.5: IC4.4 22.15,24.85
  Bottom 0.3: v20,66.7 20,57.03 IC1.10 | v6,74.5 v6,78.5 | v23,92 36,92 v36,96
  Bottom 0.5: v21,26 21,52.27 IC1.10
A1  (via drill 0.6)
  Top 0.3: v43,56.12 42.5,56.1 40.1,56.1 39.65,55.68 36,55.68 35.31,56.69 IC1.9 21.19,56.69 13.5,49 v12,49 | IC3.63 50,88 49,89 v47.5,89
  Bottom 0.3: v12,49 12,59.5 7,59.5 5.5,61 5.5,66.71 X1.37 | v43,56.12 43,67 47.5,71.5 v47.5,89
A2  (via drill 0.6)
  Top 0.3: v41.5,60.22 36,60.22 35.23,59.23 IC1.8 21.23,59.23 15,53 v13,53 | IC3.67 47,86 v46.5,86.5
  Bottom 0.3: v13,53 13,66.71 X1.40 | v41.5,60.22 41.5,66.5 46.5,71.5 v46.5,86.5
A3  (via drill 0.6)
  Top 0.3: v36.5,65.5 36,65.5 32.27,61.77 IC1.7 21.27,61.77 15,55.5 v14,55.5 | v14,67 7.71,67 X1.39 | IC3.68 44,85.5 v43.5,85
  Bottom 0.3: v14,55.5 v14,67 | v36.5,65.5 36,66 36,67.5 36.5,68 39.5,68 43.5,72 v43.5,85
A4  (via drill 0.6)
  Top 0.3: v24,78.5 25,78.5 29,82.5 42.5,82.5 44,84 45,84 45.5,83.5 54,83.5 55,84.5 IC3.70
  Bottom 0.3: IC1.6 24.31,64.31 25,65 25,77.5 v24,78.5 14.21,78.5 X1.42
A5  (via drill 0.6)
  Top 0.3: IC3.72 56,83.5 56,78 v42.5,78 | v42.5,74.5 40.9,72.9 29.03,72.9 IC1.5 22.73,67 21,67 20,68 20,71.5 v18,71.5
  Bottom 0.3: X1.41 7.25,73.25 8.5,72 17.5,72 v18,71.5 | v42.5,74.5 v42.5,78
A6  (via drill 0.6)
  Top 0.3: IC3.75 58,82 57.5,81.5 57,81.5 57,77 v41,77 | IC1.4 22.88,69.62 | 22.88,69.62 19.5,72.8 12.5,72.8 10.5,71 10.5,70.5 9.5,69.5 v8,69.5 | 22.88,69.62 26.76,73.45 40,73.45 40,73.5 v41,74.5
  Bottom 0.3: X1.32 8.75,60.75 7,62.5 7,68.5 v8,69.5 | v41,74.5 v41,77
A7  (via drill 0.6)
  Top 0.3: v7,72 10,72 11.5,73.5 20,73.5 21.57,71.93 IC1.3 26.45,75.5 61,75.5 IC3.77
  Bottom 0.3: v7,72 3,72 2.5,71.5 2.5,62.21 X1.31
A8
  Top 0.3: X1.34 29.25,63.3 35.5,69.5 38.01,69.5 IC1.25 38.23,69.5 53.5,69.5 54.5,70.5 61,70.5 62,71.5 IC3.79
A9  (via drill 0.6)
  Top 0.3: X1.27 6.75,55.75 8,57 15.5,57 21.5,62.75 30.5,62.75 34.5,67 37.97,67 IC1.24 | IC3.71 55.5,84 54.5,83 v44.5,83
  Bottom 0.3: v44.5,83 44.5,71.5 40,67 38.27,67 IC1.24
A10  (via drill 0.6)
  Top 0.3: v18,47 19,47.75 40.25,47.75 | IC3.64 49,87.5 v48.5,88 | 38.35,59 IC1.21
  Top 0.305: 38.35,59 v44,59 | 40.25,47.75 41.25,47.75 v44,50.5
  Bottom 0.3: 6,57 6,52.5 7.5,51 7.5,47 v18,47 | v44,59 44,67 48.5,71.5 v48.5,88
  Bottom 0.305: v44,59 v44,50.5 | 6,57 7.25,58.25 X1.30
A11  (via drill 0.6)
  Top 0.3: X1.29 5.75,58.25 7,59.5 10,59.5 v11,58.5 | v11,48 v11,46 | v13,43 16,43 18.5,45.5 42,45.5 | v45,63 38.93,63 IC1.23 | IC3.69 50,85 v49.5,84.5
  Top 0.305: 42,45.5 42.38,45.5 v45,48.12
  Bottom 0.3: v11,58.5 v11,48 | v11,46 11,45 v13,43 | v45,63 45,66.5 49.5,71 v49.5,84.5
  Bottom 0.305: v45,48.12 v45,63
A12
  Top 0.3: X1.33 2.5,64.71 2.5,74 3,74.5 4.5,74.5 5.5,75.5 7,75.5 8,74.5 10,74.5 11.5,76 21.5,76 22.88,74.62 IC1.2 24.41,76 60.5,76 IC3.76
A13
  Top 0.3: X1.36 9.01,65.8 29.75,65.8 36,72 38.05,72 IC1.26 38.19,72 61,72 61.5,72.5 IC3.78
A14  (via drill 0.6)
  Top 0.3: X1.35 6.75,65.75 8,64.5 20,64.5 21,65.3 30.3,65.3 35.5,70.5 v36.5,70.5
  Bottom 0.3: v36.5,70.5 36,70.5 36,74.5 36.03,74.47 IC1.27
BUSDIR
  Top 0.3: IC3.81 63,68.5 62,67.5 54.5,67.5 49,62 49,55.17 21.5,55.17 12.25,46.25 12.25,45.25 11.5,44.5 10.21,44.5 X1.20
CLOCK  (via drill 0.6)
  Top 0.3: 63,49.5 66.5,53 66.5,68 66,69 v66,75 IC3.87 | v47.5,90.5 v36,90.5 | v24,90.5 13.71,90.5 X1.52
  Top 0.305: IC4.24 41.84,32.47 44.5,34.62 44.5,39 55,49.5 63,49.5
  Bottom 0.3: v24,90.5 v36,90.5 | v66,75 66,78.5 59.5,78.5 56,82 56,90.5 v47.5,90.5
CT1
  Top 0.5: R12.2 51.05,43.05 46.5,38.5 46.5,29.5 40.5,23.5 35,23.5 26,14.81 26,12.15 IC4.9
D0  (via drill 0.6)
  Top 0.3: IC3.98 v71.5,78 | IC4.10 26.61,9.61 v27.5,10.5 | v27.5,51.5 22.99,51.5 IC1.11 | 43,52 51.5,52 52,51.5 v59.5,51.5 | 40.5,50.3 29,50.3 | v24,80.5 14,80.5 9.25,75.75 X1.44
  Top 0.305: 40.5,50.3 41.3,50.3 43,52 | 29,50.3 28.7,50.3 v27.5,51.5
  Bottom 0.3: v27.5,10.5 v27.5,51.5 27.5,82.5 26,82.5 v24,80.5 | v71.5,78 71,77.5 71,70.5 65.5,64.5 65.5,53.5 63.5,51.5 v59.5,51.5
D1  (via drill 0.6)
  Top 0.3: IC3.50 60.5,97 59.5,97 v56.5,100 | v52.5,100 51.5,100 50.5,99 33,99 28.5,94.5 28.5,86.5 v25.5,83.5 24.5,82.5 15,82.5 9.5,77 5.21,77 X1.43 | v28.5,49 22.95,49 IC1.12
  Bottom 0.3: v56.5,100 v52.5,100 | IC4.12 25.53,4.53 28.5,7.5 v28.5,49 28.5,83.5 v25.5,83.5
D2  (via drill 0.6)
  Top 0.3: IC3.48 61.5,98.5 58.5,101.5 v55.5,101.5 | v50,100 32.5,100 27.5,95 27.5,87 17.71,87 X1.46 | v20,46.5 22.85,46.5 IC1.13 | IC4.13 36.47,4.53 35,5.75 21,5.75 v20,7
  Bottom 0.3: v55.5,101.5 51.5,101.5 v50,100 | v20,7 v20,46.5 | IC1.13 25.75,49.65 25.75,78 24.5,79.5 14,79.5 12.75,78.25 X1.46
D3  (via drill 0.6)
  Top 0.3: IC3.52 57.5,93.5 v57,94 | IC4.14 34.43,7.07 v29.5,12 | v29.5,44 33.5,44 34.5,45 35.5,45 36.5,44 IC1.15 | v29.5,83.35 42,83.35 42.5,83.8 v42.5,86.5
  Bottom 0.3: v57,94 55,94 55,95 42.5,95 v42.5,86.5 | v29.5,12 v29.5,44 v29.5,83.35 29.5,84.5 25,84.5 24,83.5 11,83.5 9.5,82 7.71,82 X1.45
D4  (via drill 0.6)
  Top 0.3: IC3.53 56.5,93 56,93.5 56,96.5 54.5,98 33.5,98 29.5,94 v29.5,86 25,81.5 v15.5,81.5 | IC4.15 34.39,9.61 v30.5,13.5 | v30.5,46.5 38.09,46.5 IC1.16
  Bottom 0.3: v30.5,13.5 v30.5,46.5 30.5,85 v29.5,86 | v15.5,81.5 11.5,81.5 11,81 9.21,81 X1.48
D5  (via drill 0.6)
  Top 0.3: IC4.16 34.35,12.15 v31.5,15 | v31.5,49 38.05,49 IC1.17 | v31.5,85.5 41.5,85.5 41.5,87.5 v43.5,87.5 | IC3.54 56,92.5 v54,94
  Bottom 0.3: v31.5,15 v31.5,49 v31.5,85.5 29.5,87.5 27,87.5 24,84.5 7.71,84.5 X1.47 | v54,94 43.5,94 v43.5,87.5
D6  (via drill 0.6)
  Top 0.3: IC4.17 34.31,14.69 v32.5,16.5 | v32.5,51.5 38.01,51.5 IC1.18 | v32.5,88.5 v44.5,88.5 | IC3.55 55,92 v54,92.7 | v26,88.5 14.21,88.5 X1.50
  Bottom 0.3: v32.5,16.5 v32.5,51.5 v32.5,88.5 | v54,92.7 44.5,92.7 v44.5,88.5
  Bottom 0.305: v26,88.5 v32.5,88.5
D7  (via drill 0.6)
  Top 0.3: IC4.18 34.27,17.23 v33.5,18.5 | v33.5,54 37.97,54 IC1.19 | v34.5,89.5 v45.5,89.5 | IC3.57 54.8,91 v54,91.45
  Bottom 0.3: v33.5,18.5 v33.5,54 33.5,85 34.5,86 v34.5,89.5 | 4.25,83.25 X1.49 | v54,91.45 45.5,91.45 v45.5,89.5 | 25,89.5 7.5,89.5 7,89 7,86.5
  Bottom 0.305: 4.25,83.25 4.75,83.25 7,85.5 7,86.5 | 25,89.5 v34.5,89.5
GND  (via drill 0.6)
  Top 0.3: IC3.59 v61,90 | IC3.43 v64,93.5 | IC3.11 v72,87 | IC3.95 v70,82.5 | IC3.86 v65.5,82.5 | IC3.74 59.5,82.5 v61,84 | IC3.38 66.5,94 v67,93.5 | IC3.26 72.5,95 71,93.5 v70.5,93.5
  Top 0.5: X2.17 X2.18 X2.20 X2.19 121,91.8 | 33.45,108 33.45,111 | 33.45,111 33.45,112 | 33.45,112 33.45,112.95 34,113.5 35.38,113.5 IC2.7 36.21,113.95 C27.2 42.55,113.95 44.5,112 45.95,112 C24.2 | IC2.9 33.41,112.04 33.45,112 | IC2.5 33.68,110.77 33.45,111 | IC2.3 33.68,108.23 33.45,108 | X7.2 70.35,108.2 62.5,108.2 X7.10 | 131.96,19.46 130.96,19.46 129.5,19.5 | 131.96,42.46 131.54,42.46 129.5,42.5 | C12.2 79.05,21 v83,21 86.95,21 C11.2 | IC8.3 80.42,50.5 v83,50.5 85.5,50.5 IC8.5 88.62,51 94,51 94,46.5 92.5,45 91.05,45 C16.2 | R11.2 80.05,40 v83,40 85.95,40 R10.2 | 55,32.55 C6.- 55.5,32.5 | C2.2 22.88,34.33 IC4.1 | C1.1 22.88,42.17 IC1.14 | 33.45,108 C13.2 | 40.5,117.9 40.6,118 | 62.5,43.96 T1.E 63.49,44.95 R20.2 C19.2 | R17.2 55.55,22.5 55.44,22.39 IC5.16
  Top 1: v1,88.5 1.25,88.25 X1.53 X1.51 | 57.87,1.13 61.5,1.1 | 61.5,1.1 67.99,1.05 | 67.99,1.05 v74,1 74.19,1.19 | v132,42.5 131.96,42.46 124.96,42.46 122.5,40 113.5,40 111.5,38 110,38 IC9.5 | X2.18 v132,91.75 | 1.27,107.27 1,107 | 20.85,117.85 v27.5,118 | 1,103.73 1,104 | 68,1.06 67.99,1.05 | v132,19.5 131.96,19.46 X4.2 120.04,19.46 117.5,22 108,22 106.5,20.5 106.5,19.31 T6.E | 1,103.5 5.27,103.5 X8A.1 | v11.5,36 v19,44 IC1.14 | v10,19.5 1,19.5 | IC4.1 v11.53,32.47 | C23.- 91.5,1 | C30.- 99,1 | C18.- 61,1.1 61.5,1.1 | v83,21 83,8.77 | 83,8.77 83,1 | v52,32 C6.- | X5.GND 124,63 124,73 X6.GND 124,78.5 v108.5,78.5 | JP2.2 83,8.77 | C8.+ v83,62.5 C7.- | C27.2 40.5,117.9 | X7.10 61.27,109.73 v58.5,112.5 | 55.5,32.5 62.5,39 62.5,43.96 | v53,59 v55,63 v58,64 v61,63 v63,59 v61,55 v58,54 v55,55 v53,59
  Top 1.5: v132,118 v61.5,118 40.6,118 v27.5,118 v1,118 1,107 1,104 1,103.5 v1,88.5 1,19.5 v1,17 1,1 v20,1 v74,1 83,1 91.5,1 99,1 v122,1 132,1 v132,19.5 v132,42.5 v132,68.5 v132,91.75 v132,118
  Bottom 0.3: C45.2 117,99 | v65.5,82.5 65.5,84 | v61,90 62,90 62.5,89.5 | v64,93.5 64,92 | v70.5,93.5 70.5,92 | v72,87 70.5,87 | v70,82.5 70,84 | v67,93.5 67,92 | v61,84 62.5,84
  Bottom 0.5: C39.2 C40.2 C41.2 C42.2 C38.1 C37.1 C36.1 C35.1 127.45,113 | C43.2 C44.2 C45.2 C46.2 C34.1 C33.1 C32.1 C31.1 117,111.5 117,113 | 117,113 127.45,113 | C48.2 62.5,90 | 127.45,113 127.45,117.95 128.5,118 | 117,113 117,118 | IC1.14 | 22.91,32.5 IC4.1 25.5,30.35 25.5,8.5 22.95,7 IC4.11 | C4.1 52,22.5 | 55,22.5 IC5.16 | IC5.8 51.89,4.61 52,4.5 | IC5.3 51.69,17.31 52,17 | IC9.5 108.86,38.19 C20.1 | 62.54,56.04 v58,54 | JP1.1 19,73.23 v19,44 | C3.2 33.45,117.95 33.5,118
  Bottom 1: v58.5,112.5 58.5,118 | 70.5,92 67,92 64,92 62.5,92 62.5,90 62.5,89.5 62.5,84 65.5,84 70,84 70.5,84 70.5,87 70.5,92 | X2.19 97.75,89.25 97.5,90 | 70.5,92 73.5,95 92.5,95 97.5,90 | v11.5,36 11.5,32 | 11.5,32 11.5,21 v10,19.5 | v11.53,32.47 11.5,32 | 52,22.5 55,22.5 | 52,22.5 52,17 52,4.5 52,1 | T3.C T4.C v108.5,78.5 T2.C 108.5,85.5 107,87 105,87 103,85 103,82.5 101.5,80 91.5,80 83,71.5 v83,62.5 v83,50.5 v83,40 v83,21 | 52,22.5 v52,32 | 97.5,90 97.5,83.5 99.77,83.5 X8B.1 | T1.E 62.54,45.46 58,50 v58,54
  Bottom 1.5: v132,91.75 132,1 52,1 1,1 v1,118 v27.5,118 33.5,118 58.5,118 117,118 128.5,118 v132,118 v132,91.75
  pour Bottom: 60,94.5 73,94.5 73,81.5 60,81.5
INT
  Top 0.3: 41.5,40 35,40 34,39 34,37 36,35 36,31.5 35.5,31 24.5,31 23.43,29.93 IC4.2 22.07,29.43 7.5,29.5 7.5,41.79 X1.18 | 53.5,50.5 62.5,50.5 65.5,53.5 65.5,66 64.5,67 IC3.84
  Top 0.305: 41.5,40 43,40 53.5,50.5
IOREQ
  Top 0.3: X1.21 4.25,48.25 8,52 15,52 21,58 | 47,62 54.5,69.5 61.5,69.5 62.5,70.5 IC3.80
  Top 0.305: 21,58 45.12,58 47,59.88 47,62
M1  (via drill 0.6)
  Top 0.3: v19,39.5 22,39.5 23,38.5 31,38.5 34.5,42 39.5,42 | v50,53 50,62 54.5,66.5 63,66.5 64,67.5 IC3.83
  Top 0.305: 39.5,42 41,42 v50,51
  Bottom 0.3: X1.19 3.96,45.54 6.5,43 6.5,40.5 7.5,39.5 v19,39.5 | v50,51 v50,53
N$1
  Top 0.5: JP1.2 22.62,77.27 IC1.1 24.5,77 28.5,81 R1.1
  Bottom 0.5: IC1.1
N$2  (via drill 0.6)
  Top 0.5: X7.7 63.96,112.54 61,115.5 v55.5,115.5 | v50,115.5 48.05,115.5 C24.1
  Bottom 0.5: v55.5,115.5 v50,115.5
N$3
  Top 0.5: X1.54 X1.56
N$4  (via drill 0.6)
  Top 0.5: T2.E 107.54,88 101.73,88 X8B.2 95.77,86.27 v95.5,86 | 86.5,72 R30.1 81.55,72.45 v81.5,72.5 81.45,72.45 R32.1 79.5,72
  Bottom 0.5: v95.5,86 v81.5,72.5
N$5
  Bottom 0.5: X8A.2 4.27,106.27 3,105 3,96.71 X1.59
N$6
  Bottom 0.5: 119,71 119,81
N$7
  Bottom 0.5: 119,56 119,66
N$8  (via drill 0.6)
  Top 0.5: R9.2 R8.2 25.55,113.45 v26,113 26,109 28,107 29.39,107 IC2.13
  Bottom 0.5: C3.1 26.5,113.5 v26,113
N$13  (via drill 0.6)
  Top 0.5: R8.1 R13.2 25.95,106.95 v26,107 | v27.5,109 28.5,108 29.2,108 IC2.12
  Bottom 0.5: v26,107 26,107.5 v27.5,109
N$15  (via drill 0.6)
  Top 0.5: Q1.2 20.14,106.59 R16.1 20.5,107.5 v23,110 | v27.5,110.75 29.66,110.75 | IC2.1 35.57,104.57 v35.5,104.5 | v32,110.5 31.5,110.75 29.66,110.75 | 29.66,110.75 IC2.10
  Bottom 0.5: v23,110 26.5,110 v27.5,110.75 | v35.5,104.5 34,104.5 33,105.5 33,109.5 v32,110.5
N$16
  Top 0.5: Q1.1 20.36,111.41 R9.1
N$17  (via drill 0.6)
  Top 0.5: R16.2 R13.1 26.95,105.05 v27,105 | v31.5,106.5 31.5,108.5 30.5,109.5 IC2.11
  Bottom 0.5: v27,105 30,105 v31.5,106.5
N$21
  Top 0.5: T6.B 109,17.45 R24.1
N$22
  Top 0.5: T6.C 111.54,14.99 R29.2
N$23
  Top 0.5: R29.1 116.46,12.55 X4.5
N$24
  Top 0.5: R23.1 116.79,24.55 X4.4
N$26
  Top 0.5: X3.5 115.41,36 109,36 104.27,40.73 IC9.3 99,37.54 D3.A
N$27  (via drill 0.6)
  Top 0.5: R31.1 99,51 v100.5,52.5
  Bottom 0.5: v100.5,52.5 112.84,52.5 X3.4
N$28
  Top 0.5: R21.1 108,50.5 111.5,47 111.5,44.96 IC9.7
N$29
  Top 0.5: R31.2 100.41,45.05 IC9.2 101.57,43.27 D3.C
N$30
  Bottom 0.5: IC5.2 46.15,19.85 44.5,21.5 44.5,26.5 41,30 38.19,30 IC4.23
N$31
  Bottom 0.5: IC5.4 46.23,14.77 43.5,17.5 43.5,22.5 41,25 38.27,25 IC4.21
N$32
  Top 0.5: C28.- 91,67 R33.1 R30.2
N$33
  Top 0.5: IC5.6 46.81,9.69 42,14.5 42,21 40.5,22.5 38.31,22.5 IC4.20
N$34
  Top 1: L1.2 54,38 C6.+
  Bottom 0.5: 47,22.5 IC5.1 47.11,22.39 47,22.5
  Bottom 1: L1.2 48,30 47,29 47,22.5 C4.2
N$35
  Bottom 0.5: IC5.5 46.27,12.23 42,16.5 42,18.5 40.5,20 38.35,20 IC4.19
N$37
  Top 0.5: IC6.7 72.73,14.77 63.5,24 R7.1
  Bottom 0.5: IC6.6 IC6.7
N$38
  Top 0.5: IC5.11 51.81,9.69 50,11.5 50,22 52,24 R7.2
N$39
  Top 0.5: C12.1 80.5,23.95 80.5,27.5 79.27,28.73 IC7.3
  Bottom 0.5: IC5.10 68.65,7.15 71,9.5 71,20.54 IC7.3
N$40  (via drill 0.6)
  Top 0.5: v69.5,11 72.5,11 IC6.5
  Bottom 0.5: IC5.12 56.27,12.23 58.5,10 64,10 65,11 v69.5,11
N$41
  Top 0.5: IC6.1 66,17.5 | IC6.1 63.65,14.77 IC5.13 | R17.1 65.5,18 IC6.1
N$42
  Top 0.5: IC6.3 65.92,12.5 62,12.5 C18.+ 60.5,11 53,11 52,12 52,18.5 53.35,19.85 IC5.15
N$43
  Top 0.5: R25.2 C25.1 C21.+ 88.08,52.5 IC8.6
N$44
  Top 0.5: C14.+ 90.77,28.73 IC7.6 IC7.7
N$45
  Top 0.5: C15.+ 77.77,31.27 IC7.2 IC7.1
N$46
  Top 0.5: C11.1 86.81,23.14 IC7.5
  Bottom 0.5: IC5.9 73.61,4.61 89.5,20 89.5,23.5 IC7.5
N$47
  Top 0.5: C14.- R14.2 R10.1
N$48
  Top 0.5: C15.- R15.2 R11.1
N$49
  Bottom 0.5: IC5.14 54.62,17.5 | 54.62,17.5 54.5,17.5 | 54.62,17.5 63.46,17.5 IC6.2
N$50  (via drill 0.6)
  Top 0.5: C17.2 v66,41.5 R20.1 | T1.C 60,42 v60.5,41.5
  Bottom 0.5: v60.5,41.5 v66,41.5
N$51
  Top 0.5: R14.1 C16.1 R18.2
N$52
  Top 0.5: R19.2 C19.1 R15.1 70.95,39.95 69,38 66.05,38 C17.1
N$53
  Top 0.5: R26.2 C26.1 C22.+ 77.42,52.5 IC8.2
N$54
  Top 0.5: C22.- 76.45,48.5 R19.1
N$55
  Top 0.5: 91.05,49.5 C21.- 87.45,44.95 R18.1
N$56
  Top 0.5: R12.1 56.51,44.95 T1.B
N$57
  Top 0.5: R26.1 C26.2 | C26.2 78.55,57.45 IC8.1 | C26.2 75,58.5 77.5,61 77.5,66.5 C29.+
N$58
  Top 0.5: R25.1 C25.2 | IC8.7 89.99,57.45 C25.2 | C25.2 91,58.5 88.5,61 88.5,66.5 C28.+
N$60
  Top 0.5: R32.2 R34.1 75,67 C29.-
N$61
  Top 0.5: R33.2 98.05,72.45 102.5,67 108.54,67 T3.E 111.04,63.66 X5.AUD
N$62
  Top 0.5: R34.2 76.55,74 98,74 102.5,77 108.5,77 111,74.5 T4.E 114.84,70.7 X6.AUD
N$63
  Top 0.5: R35.1 106,84.46 T2.B
N$64  (via drill 0.6)
  Top 0.5: R36.2 103.05,59.05 v103,59 | R35.2 103.05,79.05 v103,79 | R37.2 103.05,69.05 v103,69
  Bottom 0.5: T5.C 101.54,20.96 99,23.5 98.5,32 96,34.5 96,50.5 99,53.5 v103,59 v103,69 v103,79
N$65
  Top 0.5: R36.1 106,64.46 T3.B
N$66
  Top 0.5: R37.1 106,74.46 T4.B
N$67
  Top 0.5: D1.A 94.5,22.8 94.5,13.5 95.45,12.55 R28.1 96.5,12 C30.+
N$68  (via drill 0.6)
  Top 0.5: C23.+ v91.5,14.81 | D2.C 101.2,28.7 99,26.5 99,21.81 T5.E
  Bottom 0.5: v91.5,14.81 T5.E
N$69
  Top 0.5: R28.2 R27.1 101.5,16.77 T5.B
OPM  (via drill 0.6)
  Top 0.3: IC4.7 25.23,17.23 v26.5,18.5 | v26.5,81.5 30.5,85.5 30.5,93.5 34,97 53,97 53,90.5 IC3.58
  Bottom 0.3: v26.5,18.5 v26.5,81.5
RD  (via drill 0.6)
  Top 0.3: v5.5,27 5.5,47.29 X1.24 | v5.5,22 11.5,22 14,19.5 22.65,19.5 | v7.5,54.5 15,54.5 21.5,60.77 39.45,60.77 v40.5,61.75 | IC3.65 47.5,87 47,87.5 v45.5,87.5
  Top 0.5: 22.65,19.5 IC4.6
  Bottom 0.3: v5.5,27 v5.5,22 | X1.24 8.96,51.04 7,53 7,54 v7.5,54.5 | v40.5,61.75 40.5,66.5 45.5,71.5 v45.5,87.5
RESET  (via drill 0.6)
  Top 0.3: IC3.89 67,76.5 v99,76.5 | IC4.3 22.27,27 v19,27 6.5,27 v6.5,46
  Top 0.5: IC5.7 48.34,6 v59.5,6 | v62.5,6 v78,6 | v99,68.5 99,53.5 96,50.5 96,29.2 D1.C | D1.C 96.5,28.5 | v94.5,26 94.5,26.7 D1.C
  Bottom 0.3: IC5.7 44.15,7.15 39.5,3 21,3 19,5 v19,27 | v6.5,46 6.5,50.71 X1.25
  Bottom 0.5: v59.5,6 v62.5,6 | v78,6 94.5,21.5 v94.5,26 | 99,68 v99,68.5 v99,76.5
ROMCE  (via drill 0.6)
  Top 0.3: v51,89 IC3.61
  Top 0.305: v46,56.62 45.5,57.12 38.68,57.12 IC1.20
  Bottom 0.3: v46,56.62 46,66 50.5,70.5 50.5,88.5 v51,89
RXD  (via drill 0.6)
  Top 0.3: v125,82.5 115.5,92.5 v98,92.5 | IC3.49 61,97.5 v60.5,98
  Top 0.5: v125,50 118.07,43.91 113.09,43.91 113,44 | 113,44 110.08,41 IC9.6 | R22.1 106.95,54.55 107,54.5 110.5,54.5 113,52 113,44
  Bottom 0.3: v60.5,98 73.5,98 75.5,96 94.5,96 v98,92.5
  Bottom 0.5: v125,82.5 v125,50
SD0  (via drill 0.6)
  Top 0.3: X2.16 122.25,93 116,93 115.5,93.5 v115,93.5 104,93.5 98.5,99 72.5,99 72.5,98 71.6,97.6 71.5,97.5 IC3.28
  Top 0.5: R38.2 87,115.5 88,116.5 v105.5,116.5
  Bottom 0.3: 123.5,94 X2.16
  Bottom 0.5: C39.1 123.5,94 | v115,93.5 109,99 109,102.5 106.5,105 106.5,115 v105.5,116.5
SD1  (via drill 0.6)
  Top 0.3: X2.15 120.75,94.5 112,94.5 v111.5,95 | IC3.30 70.5,98.5 v71,99
  Top 0.5: R39.2 91,115 91.5,115.5 v104,115.5
  Bottom 0.3: v71,99 73.5,99 76,96.5 95,96.5 96.5,95 v111.5,95
  Bottom 0.406: 120.75,94 X2.15
  Bottom 0.5: C43.1 120.75,94 | v111.5,95 107.5,98.5 107.5,101.5 105,104 105,114.5 v104,115.5
SD2  (via drill 0.6)
  Top 0.3: X2.14 122.25,95.5 113,95.5 112.5,96 v107,96 102.5,96 99,99.5 72,99.5 72,98.5 71,98 IC3.29
  Top 0.5: R40.2 93.05,113.95 v93,114
  Bottom 0.3: 123.5,96.5 X2.14
  Bottom 0.5: C40.1 123.5,96.5 | v107,96 106,96.5 106,100.5 103.5,103 103.5,114 102.5,115 94,115 v93,114
SD3  (via drill 0.6)
  Top 0.3: X2.1 119.25,111.75 117,110 108.5,110 105,114 99.05,114 | R41.2 97.05,113.95 | v97,107.5 95.5,106 62,106 IC3.47
  Top 0.5: 99.05,114 R41.2 | 97.05,113.95 v97,114
  Bottom 0.3: v97,114 v97,107.5
  Bottom 0.406: C31.2 120.75,111.5 X2.1
SD4  (via drill 0.6)
  Top 0.3: X2.13 120.75,97 103.5,97 v103,97.5 102,97.5 99.5,100 70,100 IC3.31
  Top 0.5: R42.2 86.45,107 v85,107
  Bottom 0.5: v103,97.5 95.5,97.5 v85,107 | C44.1 120.75,96.5 X2.13
SD5  (via drill 0.6)
  Top 0.3: X2.12 123.25,99.25 122,98 104.5,98 v104,98.5 102,98.5 100,100.5 69.5,100.5 IC3.32
  Top 0.5: R43.2 90.45,107 v89,107
  Bottom 0.3: 123.5,99 X2.12
  Bottom 0.5: C41.1 123.5,99 | v104,98.5 98.5,98.5 v89,107
SD6  (via drill 0.6)
  Top 0.3: X2.11 120.75,99.5 v105,99.5 102,99.5 100.5,101 69,101 IC3.33
  Top 0.5: R44.2 94.45,107 v93,107
  Bottom 0.5: v105,99.5 101.5,99.5 v93,107 | X2.11 120.75,99 C45.1
SD7
  Top 0.3: X2.2 123.25,111.75 122,110.5 119.5,110.5 117.5,109 101.5,109 100.05,107.55 R45.2 99,106.5 98,105.5 62.5,105.5 IC3.46
  Bottom 0.5: C35.2 123.75,111.5 X2.2
SLT3  (via drill 0.6)
  Top 0.3: v48,53 v36.5,53 21.25,53 11,42.5 11,40.29 X1.14 | v67.5,68.5 67.5,75.5 66.5,76 IC3.88
  Bottom 0.3: v48,53 48,62 54.5,68.5 v67.5,68.5 | IC1.22 36.27,61.77 36,61.5 36,53 v36.5,53
ST0
  Top 0.3: X2.3 119.75,109.25 118,108 101.5,108 98.5,105 63,105 IC3.45
  Bottom 0.5: C32.2 120.75,109 X2.3
ST1
  Top 0.3: X2.4 123.25,109.25 122,108 120,108 118.5,107 101.5,107 99,104.5 63.5,104.5 IC3.44
  Bottom 0.5: C36.2 123.75,109 X2.4
ST2
  Top 0.3: X2.5 120.75,106.5 119.5,106.5 119,106 101.5,106 99.5,104 64.5,104 IC3.42
  Bottom 0.5: C33.2 120.75,106.5 X2.5
ST3
  Top 0.3: X2.6 123.25,106.75 122,105.5 120,105.5 119.5,105 101.5,105 100,103.5 65,103.5 IC3.41
  Bottom 0.5: C37.2 123.75,106.5 X2.6
ST4
  Top 0.3: X2.7 120.75,104 102,104 101,103 65.5,103 IC3.40
  Bottom 0.5: C34.2 120.75,104 X2.7
ST5
  Top 0.3: X2.8 123.25,104.25 122,103 102,103 101.5,102.5 67,102.5 IC3.37
  Bottom 0.5: C38.2 123.75,104 X2.8
ST6
  Top 0.3: X2.9 120.25,102 67.5,102 IC3.36
  Bottom 0.5: C46.1 120.75,101.5 X2.9
ST7
  Top 0.3: X2.10 123.25,101.75 122,100.5 102.5,100.5 101.5,101.5 68,101.5 IC3.35
  Bottom 0.5: C42.1 123.75,101.5 X2.10
TCK  (via drill 0.6)
  Top 0.3: 58,88.5 IC3.62 v61,88.5
  Top 0.5: R47.2 73.26,113.95 X7.1
  Bottom 0.3: X7.1 71.27,112.27 70,111 66,111 65.2,110.5 65.2,109 64.5,108.5 59.5,108.5 59.5,89.5 v61,88.5
TDI  (via drill 0.6)
  Top 0.3: IC3.4 76,83.5 78,85.5 v78,97.5
  Top 0.5: R46.2 59.74,113.95 X7.9
  Bottom 0.3: v78,97.5 78,108.5 72.5,114.5 63.65,114.5 X7.9
TDO  (via drill 0.6)
  Top 0.3: IC3.73 57.5,83 v57,82.5
  Top 0.5: 69,112.31 X7.3 72.77,116 79.5,116 80.5,115 R48.2
  Bottom 0.3: X7.3 69.04,112.46 68,113.5 66,113.5 65.3,113 65.3,111.5 64.5,111 58,111 58,83 57.5,82.5 v57,82.5
TMS  (via drill 0.6)
  Top 0.3: IC3.15 76,89 76.5,89.5 v76.5,97.5 | v73.5,111 67.77,111 X7.5
  Top 0.5: R49.2 52.5,114 55,116.5 62.27,116.5 X7.5
  Bottom 0.3: v76.5,97.5 76.5,108 v73.5,111
TXD  (via drill 0.6)
  Top 0.3: v124,81.5 114.5,91.5 97.5,91.5 90.5,98.5 73,98.5 73,97.5 72.1,97.1 72,97 IC3.27
  Top 0.5: v124,12 122,9.5 109.05,9.5 R24.2
  Bottom 0.5: v124,81.5 v124,12
WAIT  (via drill 0.6)
  Top 0.3: v19,37.5 31.5,37.5 35,41 40.5,41 | v65.5,67.5 65.5,68 65,69 IC3.85
  Top 0.305: 40.5,41 42,41 v51,50
  Bottom 0.3: X1.17 3.96,43.04 5.5,41.5 5.5,38 6.5,37 18.5,37 v19,37.5 | v65.5,67.5 64.5,66.5 54.5,66.5 50,62 50,55.5 51,54.5 v51,50
WR  (via drill 0.6)
  Top 0.3: IC3.1 v74.5,80.5 | v63,48.5 55.12,48.5 45.38,38.75 45.38,31.88 39.62,26.12 26.7,26.12 IC4.5 | 3.75,50.75 2.5,49.5 2.5,25 3,24.5 11.5,24.5 14,22 22.69,22
  Top 0.5: X1.23 3.75,50.75 | 22.69,22 IC4.5
  Bottom 0.3: v74.5,80.5 74.5,79.5 72,77 72,70 66.5,64 66.5,52 v63,48.5
(copper drawn outside any net)
  shapes: Bottom circle x7, Top circle x5

### Text on the board
tNames: JTAG | . | GND | Russian Bear | MUSIC | Version 1.1 | KEYBOARD | EPM7160STC100 | BIOS | Version | GND | AUDIO L | KEY | Service Crew | GND | + | + | 4.7uF | 4.7uF | AUDIO R | + | + | 100uF | 100uF | GND | + | + | 4.7uF | 4.7uF | MIDI IN | OPM Module | SFG05/01-B | + | 47uF | X3 | 4.7uF | 4.7uF | + | + | MIDI OUT | RBSC | + | 2017 | 10uF | GND | + | + | 47uF | 10uF | X4 | EXT PWR | +5V
bNames: Optional. Use / with 74HCT04 | Version 1.1 | OPM Module | Russian Bear | SFG05/01-B | Service Crew | RBSC | 2017